# Altium schematic sheet design_15.SchDoc: design
size 414 x 279 mm; Date: 1/25/2021 11:39:22 PM; SheetNumber: 16; Origin: Eagle; GateName_1: G$1; SymbolName_1: A3-L-GUMSTIX; LibraryName: qualified_1; DeviceSetName: A3-L-GUMSTIX; A: A; B: B; C: C; D: D; E: E; F: F; G: G; H: H; 1: 1; 2: 2; 3: 3; 4: 4; 5: 5; Sheet: Sheet:; C:/Gumstix/gumstix-logo-16.bmp: C:/Gumstix/gumstix-logo-16.bmp; Board: Board:
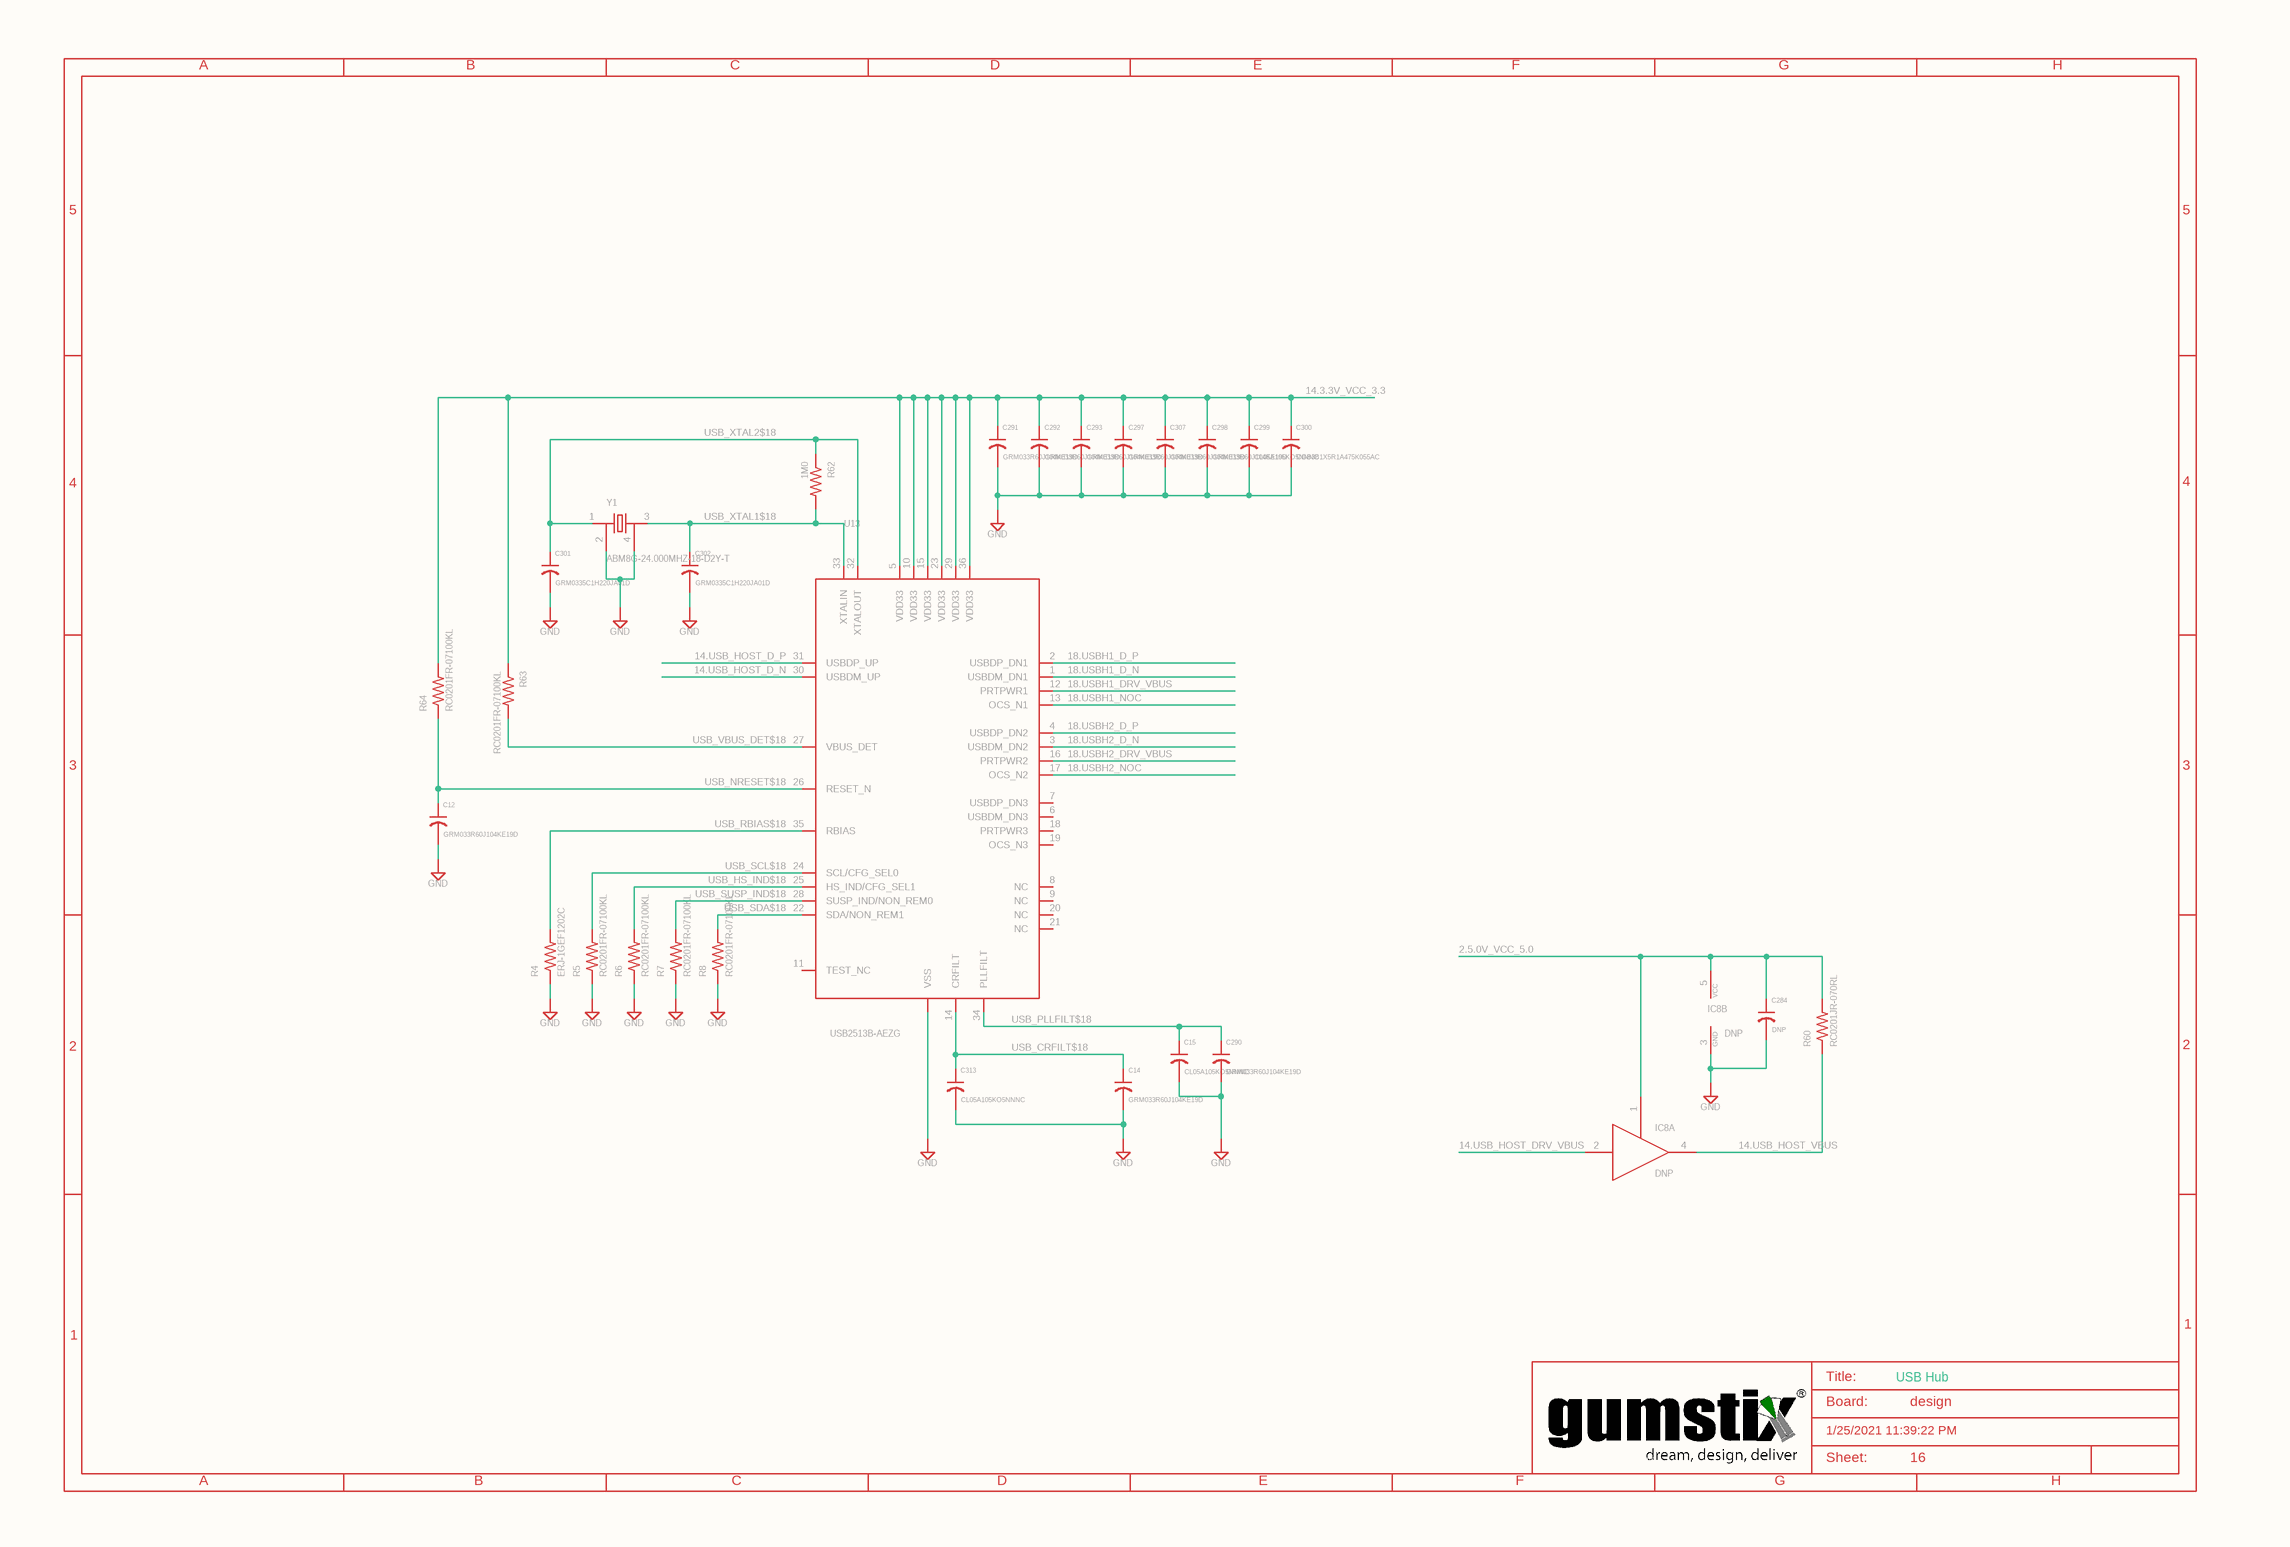
[diagram p0: design_15.SchDoc]

## Parts
C12  GRM033R60J104KE19D  [0201]
C14  GRM033R60J104KE19D  [0201]
C15  CL05A105KO5NNNC  [0402]
C284  DNP  [0402]
C290  GRM033R60J104KE19D  [0201]
C291  GRM033R60J104KE19D  [0201]
C292  GRM033R60J104KE19D  [0201]
C293  GRM033R60J104KE19D  [0201]
C297  GRM033R60J104KE19D  [0201]
C298  GRM033R60J104KE19D  [0201]
C299  CL05A105KO5NNNC  [0402]
C300  CGB3B1X5R1A475K055AC  [0603]
C301  GRM0335C1H220JA01D  [0201]
C302  GRM0335C1H220JA01D  [0201]
C307  GRM033R60J104KE19D  [0201]
C313  CL05A105KO5NNNC  [0402]
IC8  DNP  [SC70-5]  (parts A,B of 2)
R4  ERJ-1GEF1202C  [0201]
R5  RC0201FR-07100KL  [0201]
R6  RC0201FR-07100KL  [0201]
R7  RC0201FR-07100KL  [0201]
R8  RC0201FR-07100KL  [0201]
R60  RC0201JR-070RL  [0201]
R62  1M0  [0201]
R63  RC0201FR-07100KL  [0201]
R64  RC0201FR-07100KL  [0201]
SUPPLY11  GND
SUPPLY13  GND
SUPPLY14  GND
SUPPLY166  GND
SUPPLY167  GND
SUPPLY168  GND
SUPPLY169  GND
SUPPLY170  GND
SUPPLY171  GND
SUPPLY174  GND
SUPPLY175  GND
SUPPLY176  GND
SUPPLY177  GND
SUPPLY178  GND
U13  USB2513B-AEZG  [QFN36-6X6MM]
Y1  ABM8G-24.000MHZ-18-D2Y-T  [CRYSTAL-3225]

## Nets
2.5.0V_VCC_5.0: C284.1 IC8.1(OE) IC8.5(VCC) R60.2
14.3.3V_VCC_3.3: C291.1 C292.1 C293.1 C297.1 C298.1 C299.1 C300.1 C307.1 R63.1 R64.2 U13.5(VDD33) U13.10(VDD33) U13.15(VDD33) U13.23(VDD33) U13.29(VDD33) U13.36(VDD33)
14.USB_HOST_D_N: U13.30(USBDM_UP)
14.USB_HOST_D_P: U13.31(USBDP_UP)
14.USB_HOST_DRV_VBUS: IC8.2(I)
14.USB_HOST_VBUS: IC8.4(O) R60.1
18.USBH1_D_N: U13.1(USBDM_DN1)
18.USBH1_D_P: U13.2(USBDP_DN1)
18.USBH1_DRV_VBUS: U13.12(PRTPWR1)
18.USBH1_NOC: U13.13(OCS_N1)
18.USBH2_D_N: U13.3(USBDM_DN2)
18.USBH2_D_P: U13.4(USBDP_DN2)
18.USBH2_DRV_VBUS: U13.16(PRTPWR2)
18.USBH2_NOC: U13.17(OCS_N2)
USB_CRFILT$18: C14.1 C313.1 U13.14(CRFILT)
USB_HS_IND$18: R6.2 U13.25(HS_IND/CFG_SEL1)
USB_NRESET$18: C12.1 R64.1 U13.26(RESET_N)
USB_PLLFILT$18: C15.1 C290.1 U13.34(PLLFILT)
USB_RBIAS$18: R4.2 U13.35(RBIAS)
USB_SCL$18: R5.2 U13.24(SCL/CFG_SEL0)
USB_SDA$18: R8.2 U13.22(SDA/NON_REM1)
USB_SUSP_IND$18: R7.2 U13.28(SUSP_IND/NON_REM0)
USB_VBUS_DET$18: R63.2 U13.27(VBUS_DET)
USB_XTAL1$18: C302.1 R62.2 U13.33(XTALIN) Y1.3
USB_XTAL2$18: C301.1 R62.1 U13.32(XTALOUT) Y1.1
NetC12_2: C12.2 SUPPLY176.?1(GND)
NetC14_2: C14.2 C313.2 SUPPLY171.?1(GND)
NetC15_2: C15.2 C290.2 SUPPLY174.?1(GND)
NetC284_2: C284.2 IC8.3(GND) SUPPLY14.?1(GND)
NetC291_2: C291.2 C292.2 C293.2 C297.2 C298.2 C299.2 C300.2 C307.2 SUPPLY13.?1(GND)
NetC301_2: C301.2 SUPPLY177.?1(GND)
NetC302_2: C302.2 SUPPLY178.?1(GND)
NetR4_1: R4.1 SUPPLY175.?1(GND)
NetR5_1: R5.1 SUPPLY168.?1(GND)
NetR6_1: R6.1 SUPPLY11.?1(GND)
NetR7_1: R7.1 SUPPLY167.?1(GND)
NetR8_1: R8.1 SUPPLY170.?1(GND)
NetSUPPLY166_?1: SUPPLY166.?1(GND) Y1.2 Y1.4
NetSUPPLY169_?1: SUPPLY169.?1(GND) U13.EPAD_EXP1_EXP2_EXP3_EXP4_EXP5_EXP6_EXP7_EXP8(VSS)

Not connected (* = marked no-connect by the designer): U13 6(USBDM_DN3) 7(USBDP_DN3) 8(NC) 9(NC) 11(TEST_NC) 18(PRTPWR3) 19(OCS_N3) 20(NC) 21(NC)

## Notes on the sheet
- A
- B
- C
- D
- E
- F
- G
- H
- 5
- 4
- 3
- 2
- 1
- Title:
- Board:
- USB Hub
- design
- C:/Gumstix/gumstix-logo-16.bmp
- 1/25/2021 11:39:22 PM
- Sheet:
- 16

## Library data of the parts
C12 C14 C290-C293 C297 C298 C307 = GRM033R60J104KE19D: GateName_1: G$1; SymbolName_1: C-US; LibraryName: qualified_1; DeviceSetName: GRM033R60J104KE19D; DM: DM; DR: DR; DX: DX; DY: DY; HEIGHT: 0.25; SHEETNO: SHEETNO
C15 C299 C313 = CL05A105KO5NNNC: GateName_1: G$1; SymbolName_1: C-US; LibraryName: qualified_1; DeviceSetName: CL05A105KO5NNNC; HEIGHT: 0.35
C284 = C0402: GateName_1: G$1; SymbolName_1: C-US; DeviceSetName: C; DeviceName: 0402; LibraryName: qualified_1; DM: DM; DR: DR; DX: DX; DY: DY; HEIGHT: 0.35; SHEETNO: SHEETNO
C300 = CGB3B1X5R1A475K055AC: GateName_1: G$1; SymbolName_1: C-US; LibraryName: qualified_1; DeviceSetName: CGB3B1X5R1A475K055AC; DM: DM; DR: DR; DX: DX; DY: DY; HEIGHT: 0.5; SHEETNO: SHEETNO
C301 C302 = GRM0335C1H220JA01D: GateName_1: G$1; SymbolName_1: C-US; LibraryName: qualified_1; DeviceSetName: GRM0335C1H220JA01D; DM: DM; DR: DR; DX: DX; DY: DY; HEIGHT: 0.25; SHEETNO: SHEETNO
IC8 = SN74LVC1G126DCKR: Single Bus Buffer Gate With 3-State Outputs; GateName_1: A; SymbolName_1: 74126; GateName_2: P; SymbolName_2: PWRN; DeviceName: DCKR; LibraryName: qualified_1; DeviceSetName: SN74LVC1G126; HEIGHT: 1.1
R4 = ERJ-1GEF1202C: GateName_1: G$1; SymbolName_1: R-US; LibraryName: qualified_1; DeviceSetName: ERJ-1GEF1202C; DM: DM; DR: DR; DX: DX; DY: DY; HEIGHT: 0.25; SHEETNO: SHEETNO
R5-R8 R63 R64 = RC0201FR-07100KL: GateName_1: G$1; SymbolName_1: R-US; LibraryName: qualified_1; DeviceSetName: RC0201FR-07100KL; DM: DM; DR: DR; DX: DX; DY: DY; HEIGHT: 0.25; SHEETNO: SHEETNO
R60 = RC0201JR-070RL: GateName_1: G$1; SymbolName_1: R-US; LibraryName: qualified_1; DeviceSetName: RC0201JR-070RL; DM: DM; DR: DR; DX: DX; DY: DY; HEIGHT: 0.25; SHEETNO: SHEETNO
R62 = R0201: GateName_1: G$1; SymbolName_1: R-US; DeviceSetName: R; DeviceName: 0201; LibraryName: qualified_1; DM: DM; DR: DR; DX: DX; DY: DY; HEIGHT: 0.25; SHEETNO: SHEETNO
SUPPLY11 SUPPLY13 SUPPLY14 SUPPLY166-SUPPLY171 SUPPLY174-SUPPLY178 = GND: SUPPLY SYMBOL; SymbolName_1: GND-2; GateName_1: GND; LibraryName: qualified_1; DeviceSetName: GND
U13 = USB2513B-AEZG: GateName_1: G$1; SymbolName_1: USB2513; LibraryName: qualified_1; DeviceSetName: USB2513B-AEZG; HEIGHT: 1
Y1 = ABM8G-24.000MHZ-18-D2Y-T: GateName_1: G$1; SymbolName_1: Y4; LibraryName: qualified_1; DeviceSetName: ABM8G-24.000MHZ-18-D2Y-T; 1: 1; 3: 3; HEIGHT: 0.8